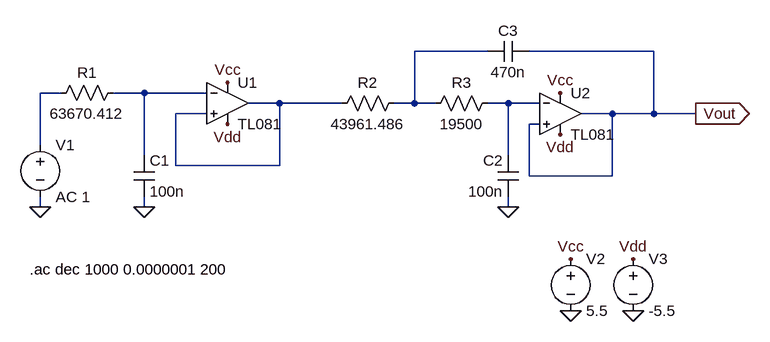
[diagram p0: schematic done_lavpasfilter3_Implementering.asc]
done_lavpasfilter3_Implementering.asc, the LTspice schematic file:
Version 4
SHEET 1 880 736
WIRE -256 192 -368 192
WIRE 0 192 -192 192
WIRE -912 256 -944 256
WIRE -784 256 -832 256
WIRE -688 256 -784 256
WIRE -576 272 -624 272
WIRE -480 272 -576 272
WIRE -368 272 -368 192
WIRE -368 272 -400 272
WIRE -336 272 -368 272
WIRE -224 272 -256 272
WIRE -176 272 -224 272
WIRE -688 288 -736 288
WIRE -64 288 -112 288
WIRE 0 288 0 192
WIRE 0 288 -64 288
WIRE 64 288 0 288
WIRE -176 304 -192 304
WIRE -944 336 -944 256
WIRE -784 352 -784 256
WIRE -224 352 -224 272
WIRE -736 368 -736 288
WIRE -576 368 -576 272
WIRE -576 368 -736 368
WIRE -192 384 -192 304
WIRE -64 384 -64 288
WIRE -64 384 -192 384
WIRE -944 432 -944 416
WIRE -784 432 -784 416
WIRE -224 432 -224 416
FLAG -128 512 Vcc
FLAG -128 592 0
FLAG -144 320 Vdd
FLAG -144 256 Vcc
FLAG 64 288 Vout
IOPIN 64 288 Out
FLAG -656 240 Vcc
FLAG -656 304 Vdd
FLAG -784 432 0
FLAG -224 432 0
FLAG -944 432 0
FLAG -32 592 0
FLAG -32 512 Vdd
SYMBOL voltage -128 496 R0
WINDOW 123 0 0 Left 2
WINDOW 39 0 0 Left 2
SYMATTR InstName V2
SYMATTR Value 5.5
SYMBOL res -384 256 R90
WINDOW 0 0 56 VBottom 2
WINDOW 3 32 56 VTop 2
SYMATTR InstName R2
SYMATTR Value 43961.486
SYMBOL res -240 256 R90
WINDOW 0 0 56 VBottom 2
WINDOW 3 32 56 VTop 2
SYMATTR InstName R3
SYMATTR Value 19500
SYMBOL cap -192 176 R90
WINDOW 0 0 32 VBottom 2
WINDOW 3 32 32 VTop 2
SYMATTR InstName C3
SYMATTR Value 470n
SYMBOL cap -800 352 R0
SYMATTR InstName C1
SYMATTR Value 100n
SYMBOL res -816 240 R90
WINDOW 0 0 56 VBottom 2
WINDOW 3 32 56 VTop 2
SYMATTR InstName R1
SYMATTR Value 63670.412
SYMBOL cap -208 416 R180
WINDOW 0 24 56 Left 2
WINDOW 3 24 8 Left 2
SYMATTR InstName C2
SYMATTR Value 100n
SYMBOL voltage -944 320 R0
SYMATTR InstName V1
SYMATTR Value AC 1
SYMBOL TL081 -656 208 R0
SYMATTR InstName U1
SYMBOL TL081 -144 224 R0
SYMATTR InstName U2
SYMBOL voltage -32 496 R0
SYMATTR InstName V3
SYMATTR Value -5.5
TEXT -960 528 Left 2 !.ac dec 1000 0.0000001 200

The netlist it stands for:
* done_lavpasfilter3_Implementering.asc
V2 Vcc 0 5.5
R2 N001 N004 43961.486
R3 N005 N001 19500
C3 Vout N001 470n
C1 N003 0 100n
R1 N003 N002 63670.412
C2 0 N005 100n
V1 N002 0 AC 1
* U1: TL081 (symbol TL081 not available, pins judged from their places): In+=N004 In-=N003 V+=Vcc V-=Vdd OUT=N004
* U2: TL081 (symbol TL081 not available, pins judged from their places): In+=Vout In-=N005 V+=Vcc V-=Vdd OUT=Vout
V3 Vdd 0 -5.5
.ac dec 1000 0.0000001 200
.backanno
.end